# EAGLE design Xduino7.0 (EAGLE 6.5.0)
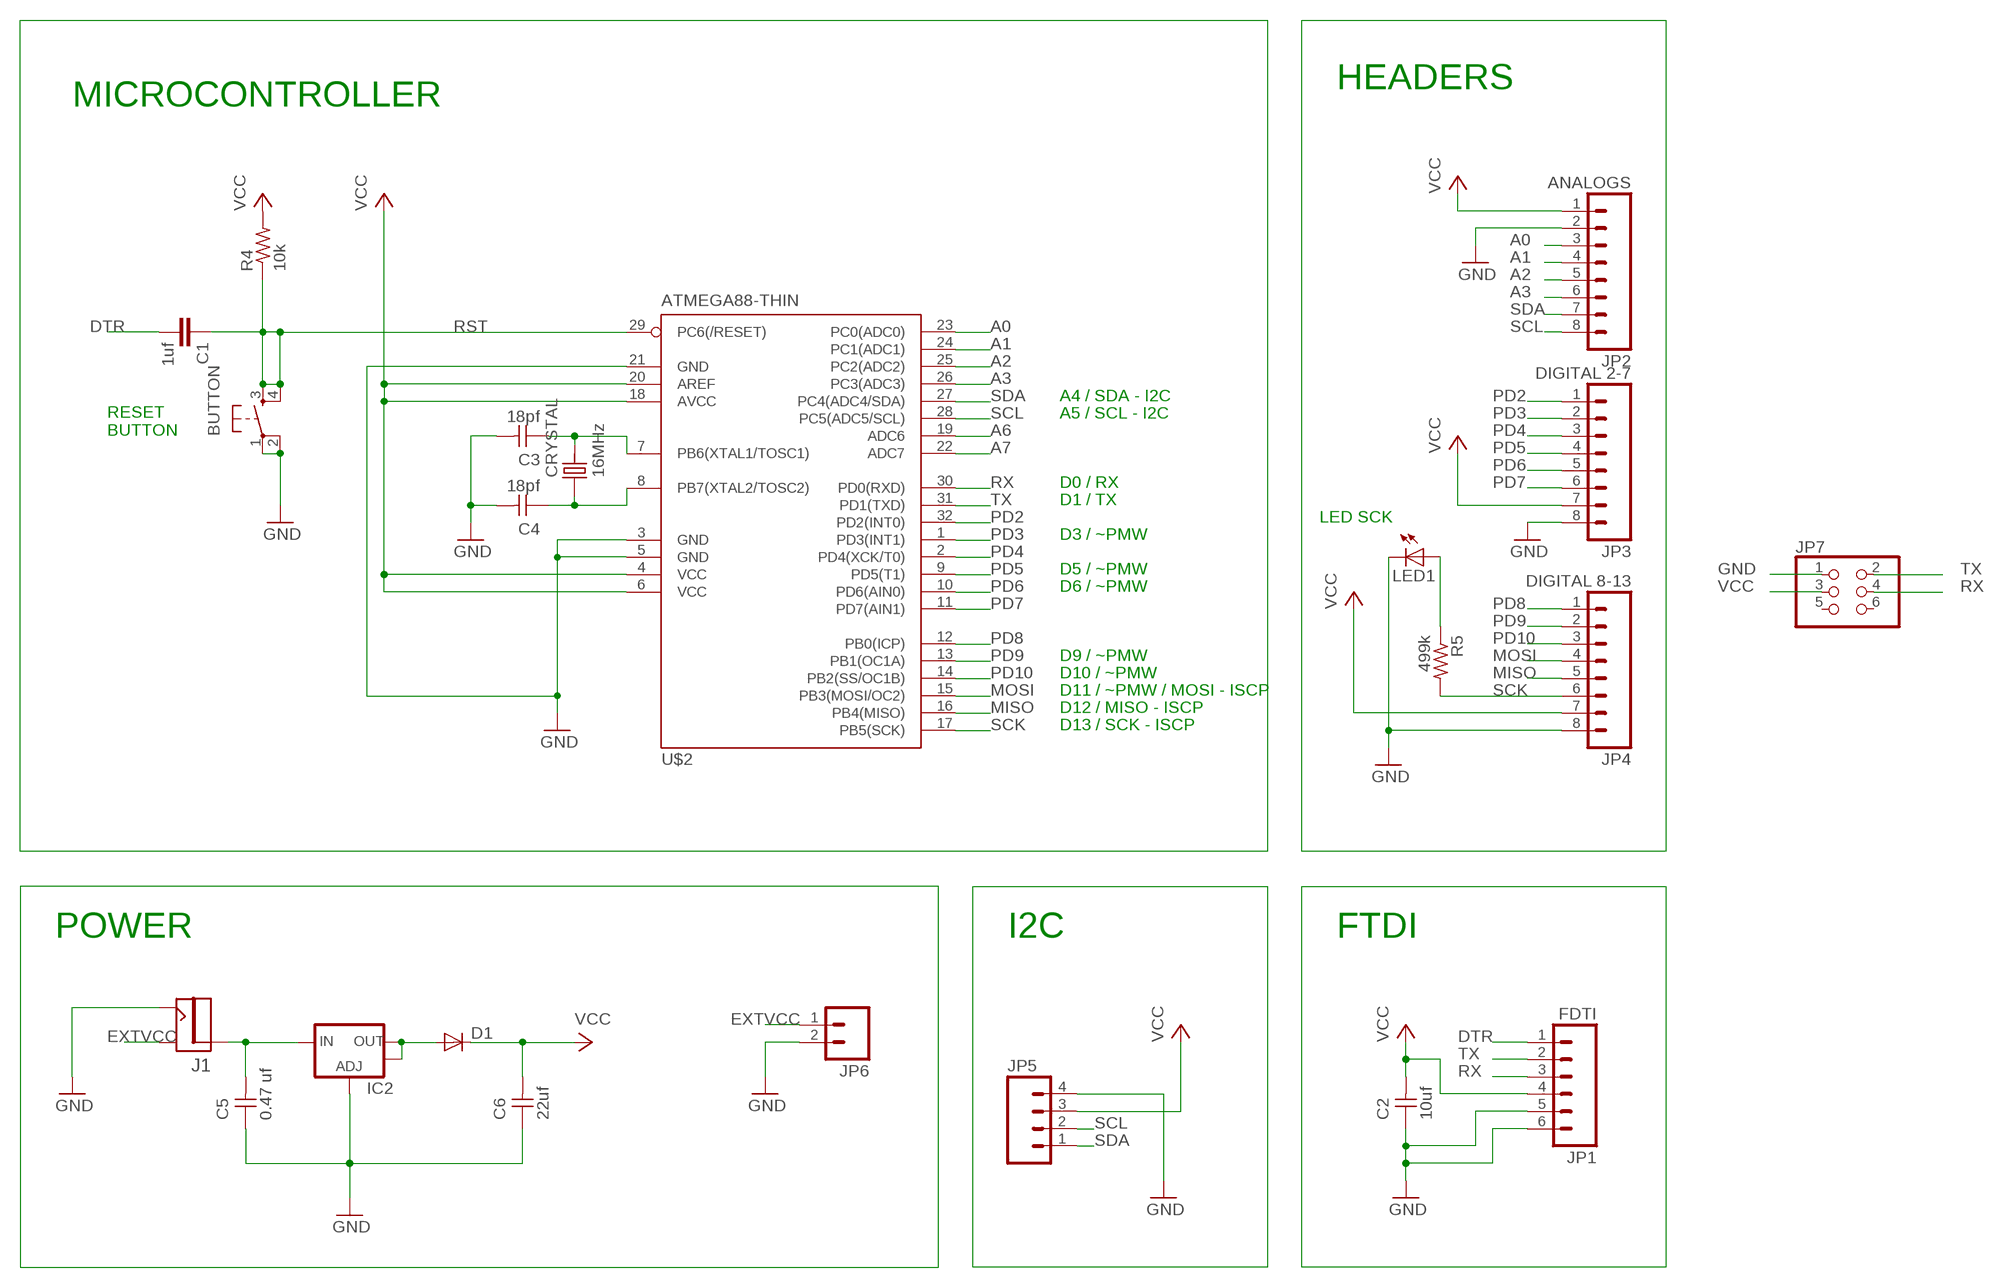
[diagram p0: schematic, sheet 1]

## Parts
BUTTON  6MM_SWITCH6MM_SWITCH  [6MM_SWITCH]
C1  1uf  CAP1206  [1206]
C2  10uf  UNPOLARIZED_CAPACITOR1206  [1206]
C3  18pf  UNPOLARIZED_CAPACITOR1206  [1206]
C4  18pf  UNPOLARIZED_CAPACITOR1206  [1206]
C5  0.47 uf  UNPOLARIZED_CAPACITOR1206  [1206]
C6  22uf  UNPOLARIZED_CAPACITOR1206  [1206]
CRYSTAL  16MHz  CRYSTALCS10  [CS10]
D1  DIODESOD123  [SOD123]
IC2  V_REG_LM1117SOT223  [SOT223]
J1  JACK.65MM  [JACK_.65MM]
JP1  FDTI  M061X06-SMD_EDGE_FEMALE  [1X06-SMD_EDGE]
JP2  ANALOGS  M08  [1X08]
JP3  DIGITAL 2-7  M08  [1X08]
JP4  DIGITAL 8-13  M08  [1X08]
JP5  M04PTH  [1X04]
JP6  M02PTH  [1X02]
JP7  PINHD-2X3-SMD  [2X03SMD]
LED1  LED1206  [1206]
R4  10k  RESISTOR1206  [1206]
R5  499k  RESISTOR1206  [1206]
U$2  ATMEGA88-THIN  [TQFP32-08THIN]

## Nets
A0: JP2.3 U$2.23(PC0(ADC0))
A1: JP2.4 U$2.24(PC1(ADC1))
A2: JP2.5 U$2.25(PC2(ADC2))
A3: JP2.6 U$2.26(PC3(ADC3))
A6: U$2.19(ADC6)
A7: U$2.22(ADC7)
DTR: C1.2 JP1.1
EXTVCC: J1.CONTACT(SHUNT) JP6.1
GND: BUTTON.1(P) BUTTON.2(P1) C2.1 C3.2 C4.2 C5.1 C6.1 IC2.1(ADJ) J1.SHUNT(CONTACT) JP1.5 JP1.6 JP2.2 JP3.8 JP4.8 JP5.4 JP6.2 JP7.1 LED1.2(C) U$2.3(GND) U$2.5(GND) U$2.21(GND)
MISO: JP4.5 U$2.16(PB4(MISO))
MOSI: JP4.4 U$2.15(PB3(MOSI/OC2))
N$2: LED1.1(A) R5.1
N$3: C5.2 IC2.3(IN) J1.PIN
N$10: C4.1 CRYSTAL.P$1 U$2.8(PB7(XTAL2/TOSC2))
N$11: C3.1 CRYSTAL.P$2 U$2.7(PB6(XTAL1/TOSC1))
N$12: D1.ANODE(A) IC2.2(OUT) IC2.4(OUT)
PD2: JP3.1 U$2.32(PD2(INT0))
PD3: JP3.2 U$2.1(PD3(INT1))
PD4: JP3.3 U$2.2(PD4(XCK/T0))
PD5: JP3.4 U$2.9(PD5(T1))
PD6: JP3.5 U$2.10(PD6(AIN0))
PD7: JP3.6 U$2.11(PD7(AIN1))
PD8: JP4.1 U$2.12(PB0(ICP))
PD9: JP4.2 U$2.13(PB1(OC1A))
PD10: JP4.3 U$2.14(PB2(SS/OC1B))
RST: BUTTON.3(S) BUTTON.4(S1) C1.1 R4.1 U$2.29(PC6(/RESET))
RX: JP1.3 JP7.4 U$2.30(PD0(RXD))
SCK: JP4.6 R5.2 U$2.17(PB5(SCK))
SCL: JP2.8 JP5.2 U$2.28(PC5(ADC5/SCL))
SDA: JP2.7 JP5.1 U$2.27(PC4(ADC4/SDA))
TX: JP1.2 JP7.2 U$2.31(PD1(TXD))
VCC: C2.2 C6.2 D1.CATHODE(C) JP1.4 JP2.1 JP3.7 JP4.7 JP5.3 JP7.3 R4.2 U$2.4(VCC) U$2.6(VCC) U$2.18(AVCC) U$2.20(AREF)
Unconnected: JP7.5 JP7.6

## Notes on the sheet
- HEADERS
- MICROCONTROLLER
- A4 / SDA - I2C
- A5 / SCL - I2C
- RESET 
  BUTTON
- D0 / RX
- D1 / TX
- LED SCK
- D3 / ~PMW
- D5 / ~PMW
- D6 / ~PMW
- D9 / ~PMW
- D10 / ~PMW
- D11 / ~PMW / MOSI - ISCP
- D12 / MISO - ISCP
- D13 / SCK - ISCP
- POWER | I2C | FTDI

## Library data of the parts
BUTTON = 01_fab:6MM_SWITCH: OMRON SWITCH
C1 = 01_SparkFun:CAP: Capacitor Standard 0603 ceramic capacitor, and 0.1" leaded capacitor.
C2-C6 = 01_FAB_Hello:UNPOLARIZED_CAPACITOR: unpolarized_capacitor
CRYSTAL = 01_ng:CRYSTAL: CRYSTAL
D1 = 01_fab:DIODE: DIODE high speed (Philips)
IC2 = 01_SparkFun:V_REG_LM1117: Voltage Regulator LM1117 Standard adjustable voltage regulator but in SMD form. Spark Fun Electronics SKU : COM-00595
J1 = 01_fab:JACK
JP1 = 01_SparkFun:M06: Header 6 Standard 6-pin 0.1" header. Use with straight break away headers (SKU : PRT-00116), right angle break away headers (PRT-00553), swiss pins (PRT-00743), machine pins (PRT-00117), and female headers (PRT-00115). Molex polarized connector foot print use with SKU : PRT-08094 with associated crimp pins and housings. NOTES ON THE VARIANTS LOCK and LOCK_LONGPADS... This footprint was designed to help hold the alignment of a through-hole component (i.e. 6-pin header) while soldering it into place. You may notice that each hole has been shifted either up or down by 0.005 of an inch from it's more standard position (which is a perfectly straight line). This slight alteration caused the pins (the squares in the middle) to touch the edges of the holes. Because they are alternating, it causes a "brace" to hold the component in place. 0.005 has proven to be the perfect amount of "off-center" position when using our standard breakaway headers. Although looks a little odd when you look at the bare footprint, once you have a header in there, the alteration is very hard to notice. Also, if you push a header all the way into place, it is covered up entirely on the bottom side. This idea of altering the position of holes to aid alignment will be further integrated into the Sparkfun Library for other footprints. It can help hold any component with 3 or more connection pins.
JP2-JP4 = 01_SparkFun:M08: Header 8 Standard 8-pin 0.1" header. Use with straight break away headers (SKU : PRT-00116), right angle break away headers (PRT-00553), swiss pins (PRT-00743), machine pins (PRT-00117), and female headers (PRT-00115).
JP5 = 01_SparkFun:M04: Header 4 Standard 4-pin 0.1" header. Use with straight break away headers (SKU : PRT-00116), right angle break away headers (PRT-00553), swiss pins (PRT-00743), machine pins (PRT-00117), and female headers (PRT-00115). Molex polarized connector foot print use with SKU : PRT-08231 with associated crimp pins and housings.
JP6 = 01_SparkFun:M02: Header 2 Standard 2-pin 0.1" header. Use with straight break away headers (SKU : PRT-00116), right angle break away headers (PRT-00553), swiss pins (PRT-00743), machine pins (PRT-00117), and female headers (PRT-00115). Molex polarized connector foot print use with SKU : PRT-08233 with associated crimp pins and housings.
JP7 = 01_fab:PINHD-2X3-SMD: PIN HEADER
LED1 = 01_ng:LED
R4 = 01_FAB_Hello:RESISTOR
R5 = 01_ng:RESISTOR
U$2 = 01_fab:ATMEGA88-THIN

## Board
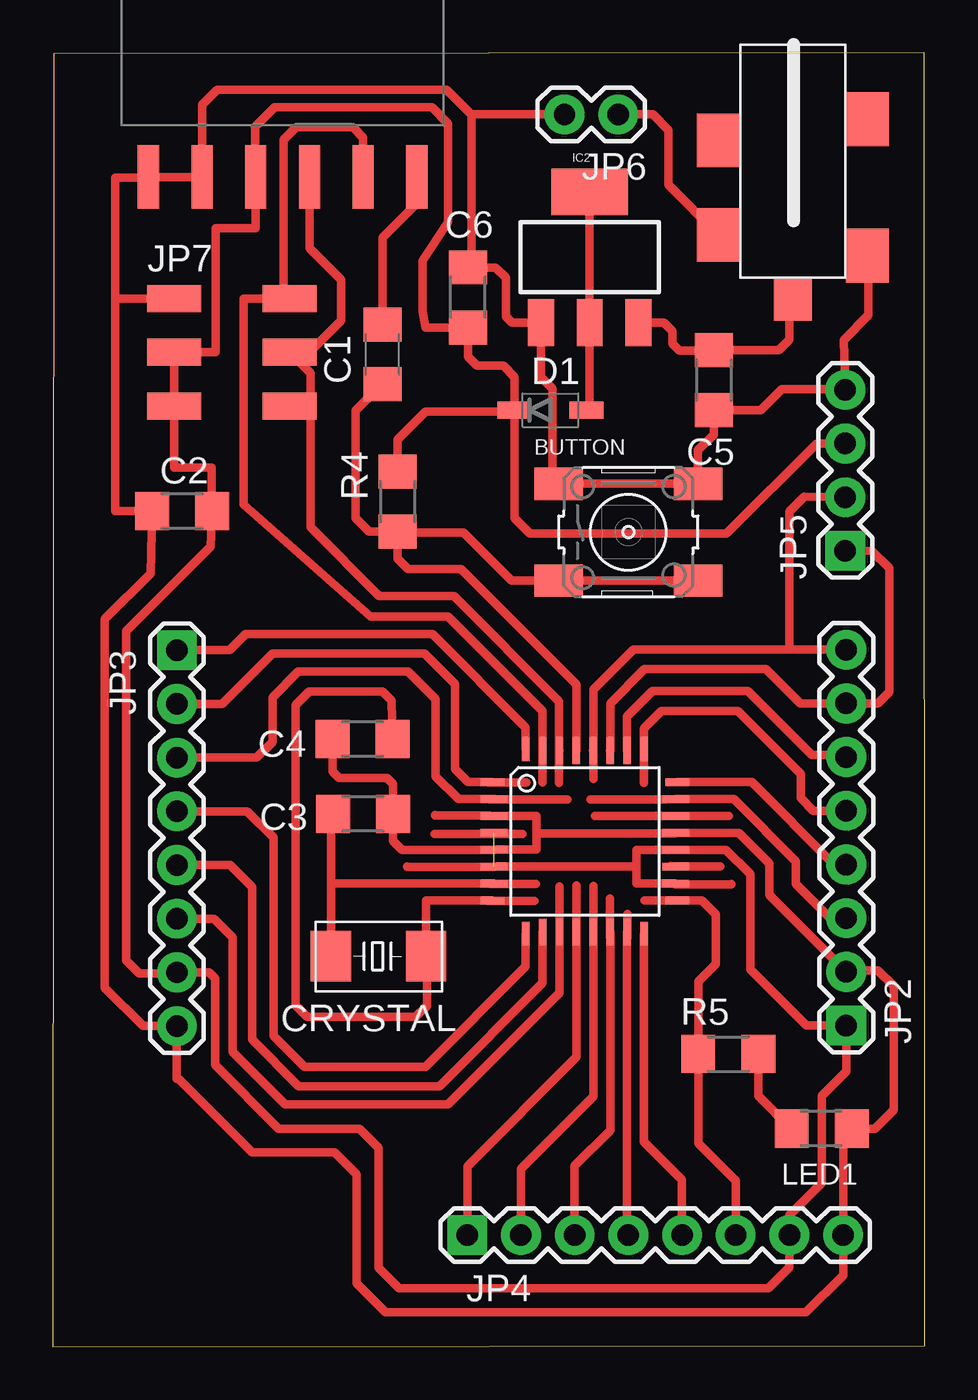
[diagram p1: board, top side]

Size 41.25 x 61.2 mm. Coordinates in mm from the lower left corner, seen from the top.
Outline: 0,0 41.25,0.05 41.22,61.2 0.05,61.15 0,0
Copper layers (1*16): Top 0.035mm / dielectric 1.5mm / Bottom 0.035mm
Design rules "default": minimum track width 10mil, minimum drill 24mil, track to track 8mil, track to pad 8mil, pad to pad 8mil, via to via 8mil, smd to smd 8mil, copper to edge 40mil, drill to drill 8mil, minimum pad ring 10mil, minimum via ring 8mil, stop-mask expansion 4mil, vias tented up to drill 0mil, thermal gap 10mil

### Footprints (pad centres in the part's own frame; a part is rotated, then mirrored left to right if it is on the bottom)
6MM_SWITCH = smd 2.286 x 1.524: 1 -3.302,2.286; 2 3.302,2.286; 3 -3.302,-2.286; 4 3.302,-2.286
1206 = smd 1.6 x 1.8: 1 -1.4,0; 2 1.4,0
1206' = smd 1.6 x 1.803: 1 -1.422,0; 2 1.422,0
CS10 = smd 1.905 x 2.388: P$1 -2.286,0; P$2 2.21,0
SOD123 = smd 1.6 x 0.8: ANODE 1.7,0; CATHODE -1.7,0
SOT223 = smd 1.219 x 2.235: 1 -2.311,-3.099; 2 0,-3.099; 3 2.311,-3.099 | smd 3.6 x 2.2: 4 0,3.099
JACK_.65MM = smd 2.032 x 2.54: CONTACT 3.578,4.026; SHIELD -3.45,-1.448; SHIELD1 3.578,-0.447; SHUNT -3.45,5.005 | smd 1.778 x 2.032: PIN 0.064,7.071
1X06-SMD_EDGE = smd 1 x 3: 1 0,-0.08; 2 2.54,-0.08; 3 5.08,-0.08; 4 7.62,-0.08; 5 10.16,-0.08; 6 12.7,-0.08
1X08 = drill 1.016 pad 1.88 square: 1 0,0 | drill 1.016 pad 1.88: 2 2.54,0; 3 5.08,0; 4 7.62,0; 5 10.16,0; 6 12.7,0; 7 15.24,0; 8 17.78,0
1X04 = drill 1.016 pad 1.88 square: 1 0,0 | drill 1.016 pad 1.88: 2 2.54,0; 3 5.08,0; 4 7.62,0
1X02 = drill 1.016 pad 1.88: 1 0,0; 2 2.54,0
2X03SMD = smd 2.54 x 1.27: 1 -2.54,2.54; 2 2.92,2.54; 3 -2.54,0; 4 2.92,0; 5 -2.54,-2.54; 6 2.92,-2.54
TQFP32-08THIN = smd 1.118 x 0.356: 1 -4.369,2.8; 8 -4.369,-2.8; 17 4.369,-2.8; 24 4.369,2.8 | smd 1.27 x 0.356: 2 -4.293,2; 3 -4.293,1.2; 4 -4.293,0.4; 5 -4.293,-0.4; 6 -4.293,-1.2; 7 -4.293,-2; 18 4.293,-2; 19 4.293,-1.2; 20 4.293,-0.4; 21 4.293,0.4; 22 4.293,1.2; 23 4.293,2 | smd 0.356 x 1.118: 9 -2.8,-4.369; 16 2.8,-4.369; 25 2.8,4.369; 32 -2.8,4.369 | smd 0.356 x 1.27: 10 -2,-4.293; 14 1.2,-4.293; 15 2,-4.293; 26 2,4.293; 27 1.2,4.293; 31 -2,4.293 | smd 0.35 x 1.27: 11 -1.2,-4.293; 12 -0.4,-4.293; 13 0.4,-4.293; 28 0.4,4.293; 29 -0.4,4.293; 30 -1.2,4.293

### Placement (x,y rotation side)
BUTTON  27.23,38.53 0 top
C1  15.6,46.94 90 top
C2  10uf  [1206']  6.12,39.52 0 top
C3  18pf  [1206']  14.68,25.2 0 top
C4  18pf  [1206']  14.66,28.75 180 top
C5  0.47 uf  [1206']  31.27,45.72 90 top
C6  22uf  [1206']  19.63,49.63 270 top
CRYSTAL  15.37,18.47 180 top
D1  23.55,44.3 0 top
IC2  25.4,51.54 0 top
J1  35.08,56.62 180 top
JP1  17.22,55.24 180 top
JP2  37.54,15.19 90 top
JP3  5.87,32.94 270 top
JP4  19.61,5.28 0 top
JP5  37.49,37.64 90 top
JP6  26.75,58.29 180 top
JP7  8.28,47.04 0 top
LED1  [1206']  36.37,10.31 0 top
R4  10k  [1206']  16.31,39.98 90 top
R5  499k  [1206']  31.95,13.84 180 top
U$2  25.17,23.9 0 top

### Tracks (layer width: path | path; a pad name or v marks a point on that pad's centre or on a via)
A0
  Top 0.406: U$2.23 32.21,25.9 35.15,22.96 35.15,21.89 36.78,20.27 JP2.3
A1
  Top 0.406: U$2.24 33.06,26.7 36.96,22.81 JP2.4
A2
  Top 0.406: U$2.25 27.97,29.24 28.8,30.07 32.41,30.07 35.38,27.1 35.38,25.96 35.99,25.35 JP2.5
A3
  Top 0.406: U$2.26 27.17,29.81 28.37,31.01 32.89,31.01 35.92,27.99 37.44,27.99 JP2.6
DTR
  Top 0.406: C1.2 15.6,52.45 17.17,54.03 17.17,55.27 JP1.1
EXTVCC
  Top 0.406: JP6.1 28.4,58.29 29.13,57.56 29.13,54.96 J1.CONTACT
GND
  Top 0.406: U$2.3 22.89,25.1 22.89,24.28 | 22.89,24.28 22.89,23.52 20.88,23.52 U$2.5 16.53,23.5 16.1,23.93 C3.2 | 22.89,24.28 29.46,24.28 U$2.21 32.47,24.3 33.91,22.86 33.91,21.36 JP2.2 37.62,17.81 39.04,17.81 39.78,17.07 39.78,11.2 38.89,10.31 LED1.2 37.39,9.91 JP4.8 37.39,3.38 35.64,1.63 15.75,1.63 14.38,3 14.38,8.15 13.33,9.19 9.42,9.19 5.94,12.67 5.87,12.67 JP3.8 4.27,15.16 2.46,16.97 2.46,34.42 4.62,36.58 C2.1 2.95,39.52 2.95,49.5 2.95,49.58 | C3.2 | C3.2 16.1,26.62 15.82,26.9 13.54,26.9 13.23,27.2 C4.2 | C4.2 | 38.56,51.58 J1.SHUNT 38.58,51.56 38.58,48.79 37.41,47.63 JP5.4 37.46,45.29 34.49,45.29 33.5,44.3 C5.1 31.27,43.15 30.53,42.42 BUTTON.2 BUTTON.1 23.65,41.1 23.65,45.31 23.09,45.87 IC2.1 21.72,48.44 21.44,48.72 21.44,50.57 20.95,51.05 C6.1 19.81,51.23 19.81,58.27 | 19.81,58.27 18.62,59.46 7.82,59.46 7.75,59.44 7.06,58.75 JP1.5 JP1.6 4.52,55.3 2.95,55.3 2.95,49.58 | JP6.2 19.84,58.29 19.81,58.27 | JP7.1 2.95,49.58
MISO
  Top 0.406: U$2.16 27.97,9.7 29.77,7.9 JP4.5
MOSI
  Top 0.406: U$2.15 27.17,5.56 JP4.4
N$1
  Top 0.406: 25.65,25.1 31.98,25.1
N$2
  Top 0.406: LED1.1 34.92,10.31 33.38,11.86 R5.1
N$3
  Top 0.406: J1.PIN 34.85,49.38 34.85,47.65 34.34,47.14 C5.2 | C5.2 | IC2.3 28.91,48.44 29.31,48.03 29.31,47.45 29.64,47.12 31.24,47.12 C5.2
N$5
  Top 0.406: 29.21,22.73 29.24,22.73 29.26,22.71 31.57,22.71
N$10
  Top 0.406: U$2.8 17.65,21.1 CRYSTAL.P$1 17.7,18.42 17.7,16.13 17.17,15.6 12.04,15.6 11.48,16.15 11.48,30.35 12.12,30.99 15.6,30.99 16.03,30.56 C4.1
N$11
  Top 0.406: CRYSTAL.P$2 13.16,22 | 13.16,22 13.16,24.43 C3.1 | U$2.7 13.25,21.9 13.16,22
N$12
  Top 0.406: IC2.4 IC2.2 25.4,44.45 D1.ANODE
N$15
  Top 0.406: 22.22,24.26 18.06,24.26
N$20
  Top 0.406: 20.65,25.88 24.36,25.88
N$21
  Top 0.406: 29.01,25.88 25.43,25.88
N$23
  Top 0.406: 26.37,19.35 26.37,21.21
N$24
  Top 0.406: 25.58,19.18 25.58,21.79
N$25
  Top 0.406: 24.76,19.28 24.76,21.82
N$26
  Top 0.406: 23.98,19.33 23.98,21.77
N$27
  Top 0.406: 20.7,21.89 22.86,21.89
N$28
  Top 0.406: 20.6,21.08 22.78,21.08
N$29
  Top 0.406: 29.74,21.11 27.99,21.11
N$30
  Top 0.406: 20.6,26.7 22.4,26.7
N$31
  Top 0.406: 25.58,29.11 25.58,26.85
N$32
  Top 0.406: 27.97,28.73 27.97,26.67
N$34
  Top 0.406: 27.18,19.33 27.18,20.47
N$35
  Top 0.406: 20.68,25.12 18.08,25.12 18.08,25.15
N$36
  Top 0.406: 29.46,21.87 32.11,21.87 32.11,21.89
PD2
  Top 0.406: 5.87,32.97 JP3.1 8.36,32.94 9.12,33.71 17.96,33.71 22.37,29.29 U$2.32
PD3
  Top 0.406: U$2.1 19.65,26.7 19.02,27.33 19.02,31.34 17.58,32.79 10.39,32.79 8,30.4 JP3.2
PD4
  Top 0.406: U$2.2 19.18,25.9 18.11,26.97 18.11,30.63 16.81,31.93 11.61,31.93 10.39,30.71 10.39,28.6 9.65,27.86 JP3.3
PD5
  Top 0.406: JP3.4 9.19,25.32 10.44,24.08 10.44,14.71 11.91,13.23 17.63,13.23 22.37,17.98 U$2.9
PD6
  Top 0.406: JP3.5 8.38,22.78 9.42,21.74 9.42,14.53 11.63,12.32 18.29,12.32 23.17,17.2 U$2.10
PD7
  Top 0.406: JP3.6 7.62,20.24 8.51,19.35 8.51,13.94 11,11.46 18.69,11.46 23.97,16.73 U$2.11
PD8
  Top 0.406: U$2.12 24.77,13.7 19.61,8.53 JP4.1
PD9
  Top 0.406: U$2.13 25.57,11.83 22.15,8.41 JP4.2
PD10
  Top 0.406: U$2.14 26.37,10.24 24.69,8.56 JP4.3
RST
  Top 0.406: BUTTON.4 BUTTON.3 21.69,36.25 19.43,38.51 16.36,38.51 R4.1 | U$2.29 24.77,31.31 19.3,36.78 16.81,36.78 16.31,37.29 R4.1 | R4.1 14.96,38.56 14.33,39.19 14.33,44.27 C1.1
RX
  Top 0.406: 23.95,28.21 23.95,30.53 18.97,35.51 15.44,35.51 12.19,38.76 12.19,46.05 JP7.4 12.14,47.04 13.64,48.54 13.64,50.47 12.14,51.97 JP1.3 | 23.95,28.21 U$2.30 | 23.95,28.21 23.95,26.67
SCK
  Top 0.406: U$2.17 30.71,21.1 31.37,20.45 31.37,18.11 30.53,17.27 R5.2 30.53,9.63 32.31,7.85 JP4.6
SCL
  Top 0.406: 25.55,28.21 U$2.28 25.57,31.08 27.46,32.97 34.72,32.97 | 34.72,32.97 JP2.8 | JP5.2 35.56,40.21 34.85,39.5 34.85,33.1 34.72,32.97
SDA
  Top 0.406: U$2.27 26.37,30.44 27.99,32.05 33.73,32.05 35.36,30.43 JP2.7 39.04,30.43 39.57,30.96 39.57,36.83 38.73,37.67 JP5.1
TX
  Top 0.406: U$2.31 23.16,30.07 18.69,34.54 15.04,34.54 9.02,39.83 9.02,49.58 JP7.2 10.92,49.86 10.92,57.1 11.51,57.68 14.2,57.68 14.68,57.2 JP1.2 | U$2.31 | U$2.31 23.16,26.7
VCC  (1 unrouted)
  Top 0.406: U$2.20 | 27.61,22.71 U$2.6 16.77,22.7 16.76,22.71 | U$2.20 27.61,23.5 27.61,22.71 | U$2.18 27.61,21.9 27.61,22.71 | U$2.20 31.85,23.5 32.99,22.35 32.99,17.86 35.66,15.19 JP2.1 37.54,13.03 36.37,11.86 36.37,7.75 34.85,6.22 JP4.7 34.85,3.76 33.86,2.77 16.38,2.77 15.42,3.73 15.42,9.4 14.5,10.31 10.69,10.31 7.67,13.34 7.67,17.42 7.39,17.7 JP3.7 5.82,17.65 4.09,17.65 3.48,18.26 3.48,33.86 7.47,37.85 C2.2 7.52,39.52 7.52,41.58 5.74,41.58 JP7.3 7.7,47.04 7.7,52.91 9.6,52.91 JP1.4 | 9.58,55.3 JP1.4 | R4.2 16.31,42.9 17.63,44.22 21.77,44.22 D1.CATHODE | D1.CATHODE 21.84,45.87 21.31,46.41 20.07,46.41 19.63,46.84 C6.2 17.63,48.21 17.5,49 17.5,51.38 18.69,53.19 18.69,57.86 17.93,58.62 10.49,58.62 9.58,57.71 9.58,55.35 JP1.4 | JP5.3 36.14,42.72 31.88,38.46 22.58,38.46 21.84,39.19 D1.CATHODE